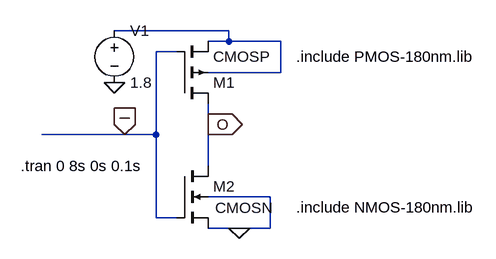
[diagram p0: schematic Inverter.asc]
Inverter.asc, the LTspice schematic file:
Version 4
SHEET 1 880 680
WIRE 176 32 0 32
WIRE 176 48 176 32
WIRE 176 48 144 48
WIRE 256 48 176 48
WIRE 96 64 64 64
WIRE 256 96 256 48
WIRE 256 96 144 96
WIRE 144 176 144 144
WIRE 16 192 -112 192
WIRE 64 192 64 64
WIRE 64 192 16 192
WIRE 144 240 144 176
WIRE 240 288 144 288
WIRE 64 320 64 192
WIRE 96 320 64 320
WIRE 192 336 144 336
WIRE 240 336 240 288
WIRE 240 336 192 336
FLAG 0 112 0
FLAG 16 192 I
IOPIN 16 192 In
FLAG 144 176 O
IOPIN 144 176 Out
FLAG 192 336 0
SYMBOL voltage 0 16 R0
WINDOW 123 0 0 Left 0
WINDOW 39 0 0 Left 0
SYMATTR InstName V1
SYMATTR Value 1.8
SYMBOL pmos4 96 144 M180
SYMATTR InstName M1
SYMATTR Value CMOSP
SYMATTR Value2 l=180n w=900n m=1
SYMBOL nmos4 96 240 R0
WINDOW 3 59 65 Left 2
SYMATTR Value CMOSN
SYMATTR InstName M2
SYMATTR Value2 l=180n w=360n
TEXT 280 72 Left 2 !.include PMOS-180nm.lib
TEXT 280 304 Left 2 !.include NMOS-180nm.lib
TEXT -144 240 Left 2 !.tran 0 8s 0s 0.1s

The netlist it stands for:
* Inverter.asc
V1 N001 0 1.8
M1 O I N001 N001 CMOSP l=180n w=900n m=1
M2 O I 0 0 CMOSN l=180n w=360n
.model NMOS NMOS
.model PMOS PMOS
.lib standard.mos
.include PMOS-180nm.lib
.include NMOS-180nm.lib
.tran 0 8s 0s 0.1s
.backanno
.end